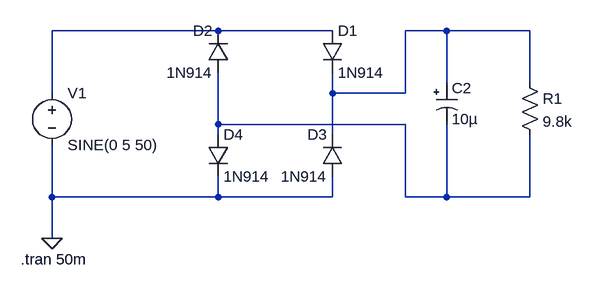
[diagram p0: schematic 2_period.asc]
2_period.asc, the LTspice schematic file:
Version 4
SHEET 1 1140 680
WIRE 32 64 -224 64
WIRE 208 64 32 64
WIRE 384 64 320 64
WIRE 512 64 384 64
WIRE 384 144 384 64
WIRE 512 144 512 64
WIRE -224 160 -224 64
WIRE 208 160 208 128
WIRE 320 160 320 64
WIRE 320 160 208 160
WIRE 32 208 32 128
WIRE 320 208 32 208
WIRE 32 224 32 208
WIRE 208 224 208 160
WIRE -224 320 -224 240
WIRE 32 320 32 288
WIRE 32 320 -224 320
WIRE 208 320 208 288
WIRE 208 320 32 320
WIRE 320 320 320 208
WIRE 384 320 384 208
WIRE 384 320 320 320
WIRE 512 320 512 224
WIRE 512 320 384 320
WIRE -224 384 -224 320
FLAG -224 384 0
SYMBOL voltage -224 144 R0
WINDOW 123 0 0 Left 2
WINDOW 39 0 0 Left 2
SYMATTR InstName V1
SYMATTR Value SINE(0 5 50)
SYMBOL diode 192 64 R0
SYMATTR InstName D1
SYMATTR Value 1N914
SYMBOL res 496 128 R0
SYMATTR InstName R1
SYMATTR Value 9.8k
SYMBOL polcap 368 144 R0
SYMATTR InstName C2
SYMATTR Value 10µ
SYMBOL diode 48 128 R180
WINDOW 0 24 64 Left 2
WINDOW 3 24 0 Left 2
SYMATTR InstName D2
SYMATTR Value 1N914
SYMBOL diode 224 288 R180
WINDOW 0 24 64 Left 2
WINDOW 3 24 0 Left 2
SYMATTR InstName D3
SYMATTR Value 1N914
SYMBOL diode 16 224 R0
SYMATTR InstName D4
SYMATTR Value 1N914
TEXT -272 416 Left 2 !.tran 50m

The netlist it stands for:
* 2_period.asc
V1 N001 0 SINE(0 5 50)
D1 N001 N002 1N914
R1 N002 N003 9.8k
C2 N002 N003 10µ
D2 N003 N001 1N914
D3 0 N002 1N914
D4 N003 0 1N914
.model D D
.lib standard.dio
.tran 50m
.backanno
.end